# EAGLE design D1MSHO (EAGLE 9.2.2)
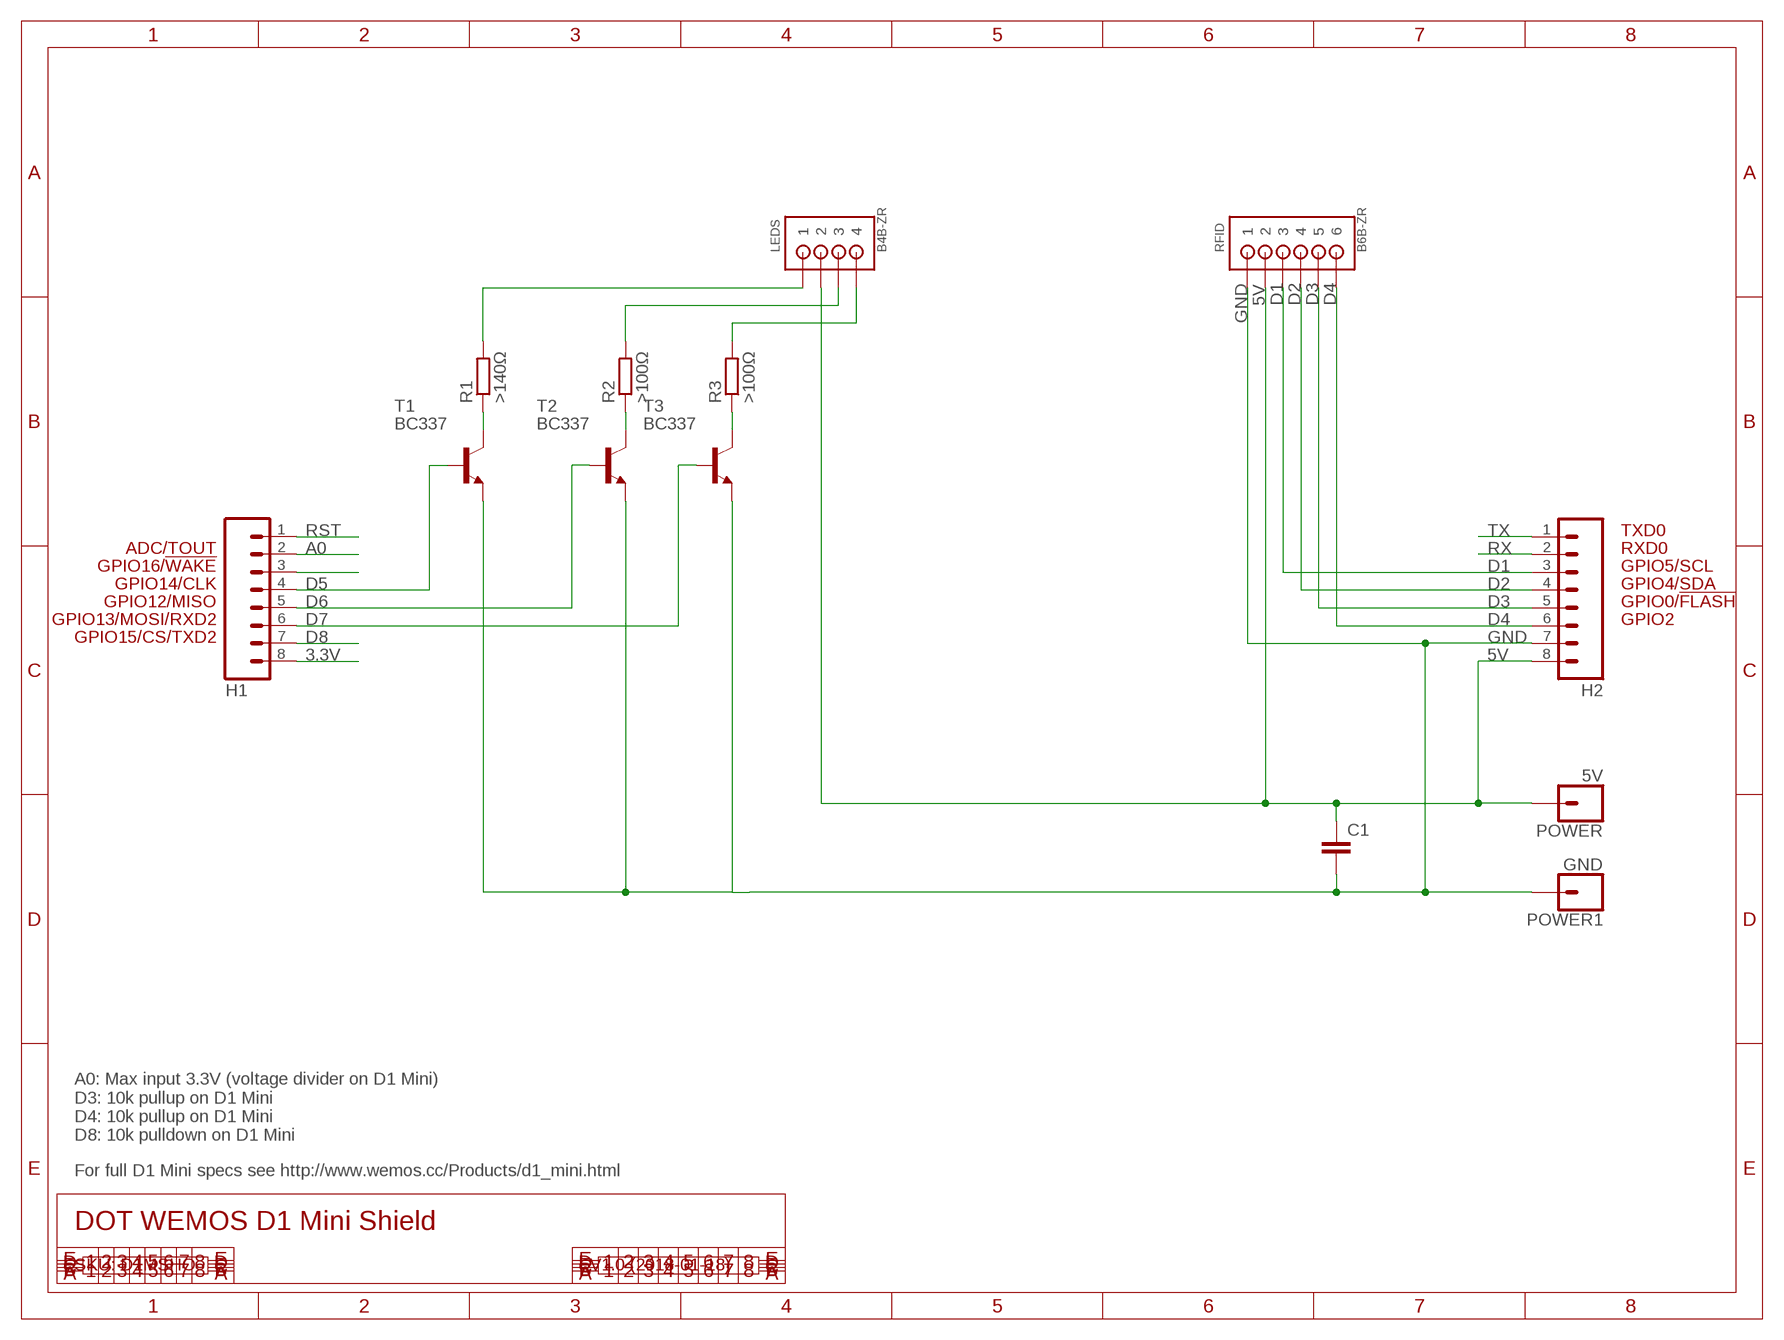
[diagram p0: schematic, sheet 1]

## Parts
C1  C-EU050-025X075  [C050-025X075]
H1  M08  [1X08]
H2  M08  [1X08]
LEDS  B4B-ZR  [B4B-ZR]
POWER  5V  CONN_01OFFSET  [1X01_OFFSET]
POWER1  GND  CONN_01OFFSET  [1X01_OFFSET]
R1  >140Ω  R-EU_0204/5  [0204/5]
R2  >100Ω  R-EU_0204/5  [0204/5]
R3  >100Ω  R-EU_0204/5  [0204/5]
RFID  B6B-ZR  [B6B-ZR]
T1  BC337  [TO92]
T2  BC337  [TO92]
T3  BC337  [TO92]

## Nets
3.3V: H1.8
5V: C1.1 H2.8 LEDS.2 POWER.1 RFID.2
A0: H1.2
D1: H2.3 RFID.3
D2: H2.4 RFID.4
D3: H2.5 RFID.5
D4: H2.6 RFID.6
D5: H1.4 T1.2(B)
D6: H1.5 T2.2(B)
D7: H1.6 T3.2(B)
D8: H1.7
GND: C1.2 H2.7 POWER1.1 RFID.1 T1.1(E) T2.1(E) T3.1(E)
N$1: R1.1 T1.3(C)
N$2: LEDS.1 R1.2
N$3: LEDS.3 R2.2
N$4: LEDS.4 R3.2
N$5: R2.1 T2.3(C)
N$6: R3.1 T3.3(C)
N$7: H1.3
RST: H1.1
RX: H2.2
TX: H2.1

## Notes on the sheet
- TXD0
- ADC/TOUT | RXD0
- GPIO16/!WAKE | GPIO5/SCL
- GPIO14/CLK | GPIO4/SDA
- GPIO12/MISO | GPIO0/!FLASH
- GPIO13/MOSI/RXD2 | GPIO2
- GPIO15/CS/TXD2
- A0: Max input 3.3V (voltage divider on D1 Mini)
  D3: 10k pullup on D1 Mini
  D4: 10k pullup on D1 Mini
  D8: 10k pulldown on D1 Mini
- For full D1 Mini specs see http://www.wemos.cc/Products/d1_mini.html
- DOT WEMOS D1 Mini Shield
- SKU: D1MSHO | V1.0 (2018-01-18)

## Library data of the parts
C1 = rcl:C-EU: CAPACITOR, European symbol; SPICEPREFIX: C
H1 H2 = freetronics-original:M08: Header 8 Standard 8-pin 0.1" header. Use with straight break away headers (SKU : PRT-00116), right angle break away headers (PRT-00553), swiss pins (PRT-00743), machine pins (PRT-00117), and female headers (PRT-00115).
LEDS = jst:B4B-ZR: JST-ZH Connector 4 pol, 1.5mm pitch Package: B4B-ZR Source: http://www.jst-mfg.com/product/pdf/eng/eZH.pdf
POWER POWER1 = SparkFun-Connectors:CONN_01: Single connection point. Often used as Generic Header-pin footprint for 0.1 inch spaced/style header connections On any of the 0.1 inch spaced packages, you can populate with these: Break Away Headers - Straight <https://www.sparkfun.com/products/116> (PRT-00116) Break Away Male Headers - Right Angle <https://www.sparkfun.com/products/553> (PRT-00553) Female Headers <https://www.sparkfun.com/products/115> (PRT-00115) Break Away Headers - Machine Pin <https://www.sparkfun.com/products/117> (PRT-00117) Break Away Female Headers - Swiss Machine Pin <https://www.sparkfun.com/products/743> (PRT-00743) This device is also useful as a general connection point to wire up your design to another part of your project. Our various solder wires solder well into these plated through hole pads. Hook-Up Wire - Assortment (Stranded, 22 AWG) <https://www.sparkfun.com/products/11375> (PRT-11375) Hook-Up Wire - Assortment (Solid Core, 22 AWG) <https://www.sparkfun.com/products/11367> (PRT-11367) View the entire wire category on our website here <https://www.sparkfun.com/categories/141> Special notes: SMTSO-256-ET is a "flush mount" nut for a 4-40 screw. We mostly use this on specialty testbeds; it is a nice way to connect hardware to your PCB at an adjustable hieght. Also note, the SNAP packages are for using a snappable style connector. We sell a baggie of snaps and they are also used on two LilyPad designs: Snap Assortment - 30 pack (male and female) <https://www.sparkfun.com/products/11347> (DEV-11347) LilyPad Arduino SimpleSnap <https://www.sparkfun.com/products/10941> (DEV-10941) LilyPad SimpleSnap Protoboard <https://www.sparkfun.com/products/10940> (DEV-10940)
R1-R3 = rcl:R-EU_: RESISTOR, European symbol; SPICEPREFIX: R
RFID = jst:B6B-ZR: JST-ZH Connector 6 pol, 1.5mm pitch Package: B6B-ZR Source: http://www.jst-mfg.com/product/pdf/eng/eZH.pdf
T1-T3 = transistor:BC337: NPN TRANSISTOR

## Net classes
0 default: width 0.203 mm, drill 0.356 mm, clearance 0.152 mm
1 power: width 0.203 mm, clearance 0.152 mm

## Board
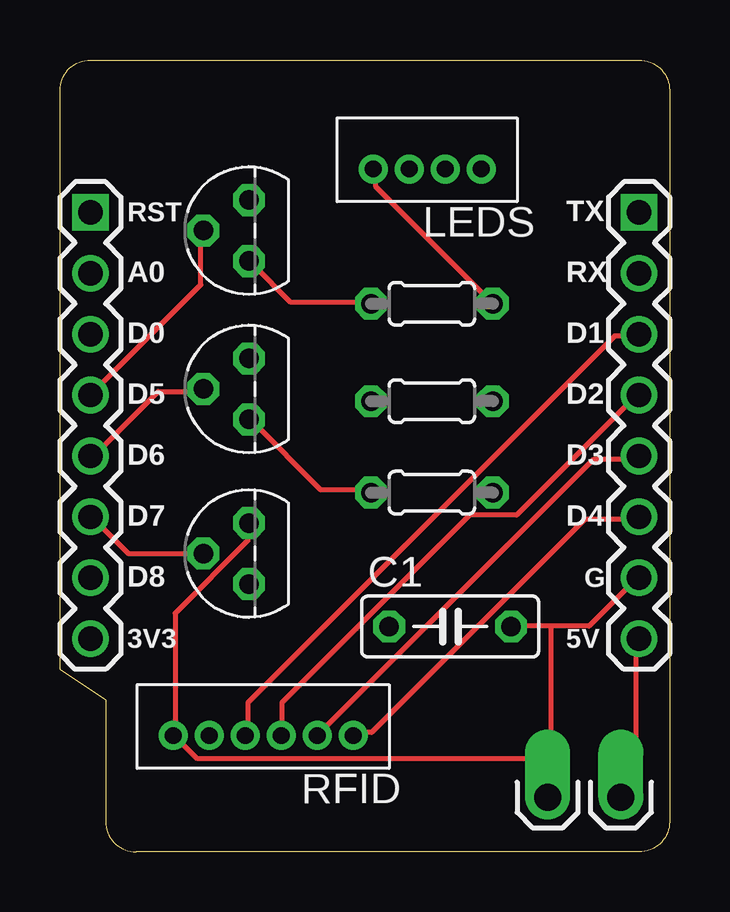
[diagram p1: board, top side]
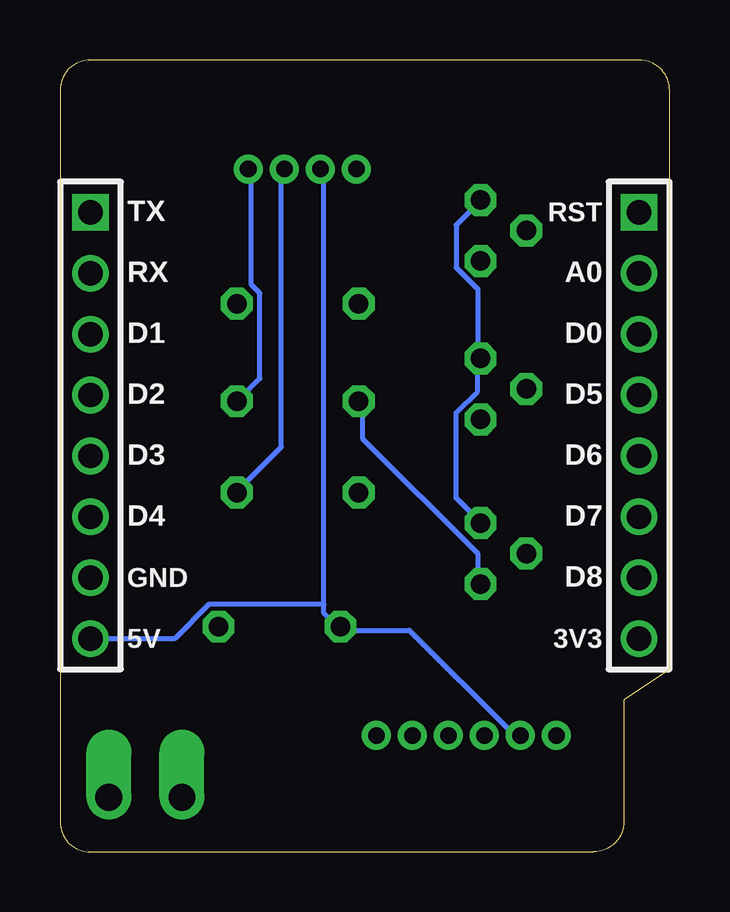
[diagram p2: board, bottom side, seen from below]

Size 25.4 x 33.02 mm. Coordinates in mm from the lower left corner, seen from the top.
Outline: 25.4,31.75 25.4,1.27 arc-90 24.13,0 3.17,0 arc-90 1.91,1.27 1.91,6.35 0,7.62 0,31.75 arc-90 1.27,33.02 24.13,33.02 arc-90 25.4,31.75
Copper layers (1*16): Top 0.035mm / dielectric 1.5mm / Bottom 0.035mm
Design rules "ElectroDragon_2layer_DRU_no_angle_20140221 *": minimum track width 6mil, minimum drill 10mil, track to track 6mil, track to pad 6mil, pad to pad 6mil, via to via 6mil, smd to smd 6mil, copper to edge 8mil, drill to drill 6mil, minimum pad ring 10mil, minimum via ring 6mil, stop-mask expansion 4mil, vias tented up to drill 100mil, thermal gap 10mil

### Footprints (pad centres in the part's own frame; a part is rotated, then mirrored left to right if it is on the bottom)
C050-025X075 = drill 0.813 octagon: 1 -2.54,0; 2 2.54,0
1X08 = drill 1.016 square: 1 0,0 | drill 1.016: 2 2.54,0; 3 5.08,0; 4 7.62,0; 5 10.16,0; 6 12.7,0; 7 15.24,0; 8 17.78,0
B4B-ZR = drill 0.7: 1 6,-1.3; 2 4.5,-1.3; 3 3,-1.3; 4 1.5,-1.3
1X01_OFFSET = drill 1.118 pad 1.88 offset: 1 0,0
0204/5 = drill 0.813 octagon: 1 -2.54,0; 2 2.54,0
B6B-ZR = drill 0.7: 1 9,-1.3; 2 7.5,-1.3; 3 6,-1.3; 4 4.5,-1.3; 5 3,-1.3; 6 1.5,-1.3
TO92 = drill 0.813 octagon: 1 1.27,0; 2 0,1.905; 3 -1.27,0

### Placement (x,y rotation side)
C1  16.26,9.4 0 top
H1  1.27,26.67 270 top
H2  24.13,26.67 270 top
LEDS  19.05,27.18 180 top
POWER  23.37,2.29 0 top
POWER1  20.32,2.29 0 top
R1  15.49,22.86 0 top
R2  15.49,14.99 0 top
R3  15.49,18.8 0 top
RFID  13.72,3.56 180 top
T1  7.87,25.91 90 top
T2  7.87,19.3 90 top
T3  7.87,12.45 90 top

### Tracks (layer width: path | path; a pad name or v marks a point on that pad's centre or on a via)
5V
  Top 0.203: H2.8 24,8.89 24,2.85 23.47,2.31 POWER.1
  Bottom 0.203: RFID.2 6.22,4.98 6.58,4.98 10.85,9.25 13.69,9.25 C1.1 13.87,9.42 14.4,9.96 14.4,10.31 | 14.4,10.31 14.4,28.45 LEDS.2 | H2.8 20.62,8.89 19.2,10.31 14.4,10.31
D1
  Top 0.203: RFID.3 7.82,4.98 7.82,6.22 23.11,21.51 24,21.51 H2.3
D2
  Top 0.203: RFID.4 9.25,4.98 9.25,6.22 17.07,14.05 19.02,14.05 24,19.02 H2.4
D3
  Top 0.203: RFID.5 10.85,4.98 22.23,16.36 24,16.36 H2.5
D4
  Top 0.203: RFID.6 12.27,4.98 12.98,4.98 21.87,13.87 24,13.87 H2.6
D5
  Top 0.203: H1.4 5.87,23.65 5.87,25.78 T1.2
D6
  Top 0.203: T2.2 5.87,19.2 4.09,19.2 1.42,16.54 H1.5
D7
  Top 0.203: T3.2 2.85,12.45 1.42,13.87 H1.6
GND
  Top 0.203: 20.45,9.42 22.05,9.42 24,11.38 H2.7 | 20.45,9.42 18.85,9.42 C1.2 | 20.45,9.42 20.45,3.91 | 20.45,3.91 20.45,2.31 POWER1.1 20.45,3.91 | T3.1 7.82,13.69 7.82,12.98 4.8,9.96 4.8,4.98 RFID.1 4.8,4.8 5.69,3.91 20.45,3.91
  Bottom 0.203: T1.1 8,27.03 8.89,26.14 8.89,24.36 8,23.47 8,20.62 T2.1 8,20.45 8,19.2 8.89,18.31 8.89,14.76 8,13.87 T3.1
N$1
  Top 0.203: R1.1 12.8,22.94 9.6,22.94 8,24.54 T1.3
N$2
  Top 0.203: R1.2 13.16,27.74 13.16,28.45 LEDS.1
N$3
  Bottom 0.203: LEDS.3 16.18,28.45 16.18,16.89 17.96,15.11 R2.2
N$4
  Bottom 0.203: LEDS.4 17.42,28.45 17.42,23.65 17.07,23.29 17.07,19.74 17.96,18.85 R3.2
N$5
  Top 0.203: R2.1 12.8,15.11 10.85,15.11 8,17.96 T2.3
N$6
  Bottom 0.203: T3.3 8,11.2 8,12.45 12.8,17.25 12.8,18.67 R3.1

### Text on the board
tPlace: RST | TX | A0 | RX | D0 | D1 | D5 | D2 | D6 | D3 | D7 | D4 | D8 | G | 3V3 | 5V
bPlace: RST | TX | A0 | RX | D0 | D1 | D5 | D2 | D6 | D3 | D7 | D4 | D8 | GND | 3V3 | 5V